# Altium schematic sheet FC-D1608HGK-572C.schdoc
size 127 x 101 mm
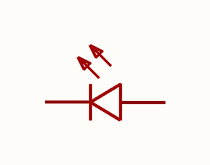
[diagram p0: FC-D1608HGK-572C.schdoc]

## Parts
LED?  ncd0603c1  [LED0603-RD]  (value not drawn)

## Nets

Not connected (* = marked no-connect by the designer): LED? 1(-) 2(+)

## Library data of the parts
LED? = ncd0603c1: 灯头类型:-;发光颜色:黄绿色;正向压降(Vf):1.6V~2.6V;功率:65mW;正向电流:25mA;波长:565nm~578nm;二极管配置:独立二极管;透镜颜色:-;色温:-;发光强度:13mcd;发光角度:140°;载带方式:-;工作温度:-30℃~+85℃;; Manufacturer: 国星光电; Symbol: FC-D1608HGK-572C; AddInBom: yes; ModelId: 1f0d29a91be547639d425604e9b96ebb; ModelTransform: 63.7794,32.283,0,0,0,0,0,0,0; Illumination Color: 黄绿色; Power(Watts): 65mW; Forward Current: 25mA; Peak Wavelength: 576nm; Diode Configuration: 独立二极管; Luminous Intensity: 13mcd; Viewing Angle: 140°; LCSC Part Name: 片式发光二极管; SupplierPart: C84264; ManufacturerPart: NCD0603C1; Supplier Footprint: 0603; JLCPCB Part Class: Extended Part; Datasheet: https://item.szlcsc.com/datasheet/NCD0603C1/85433.html; Supplier: LCSC; ConvertToPcb: yes; FootprintName: LED0603-RD; ModelName: LED0603-RD; Lamp Holder Type: -; Voltage - Forward(Vf): 1.6V~2.6V; Wavelength - Dominant: 565nm~578nm; Lens Color: -; Color Temperature: -; Mounting Style: -; Operating Temperature: -30℃~+85℃